# EAGLE schematic MCDU (EAGLE 7.5.0)
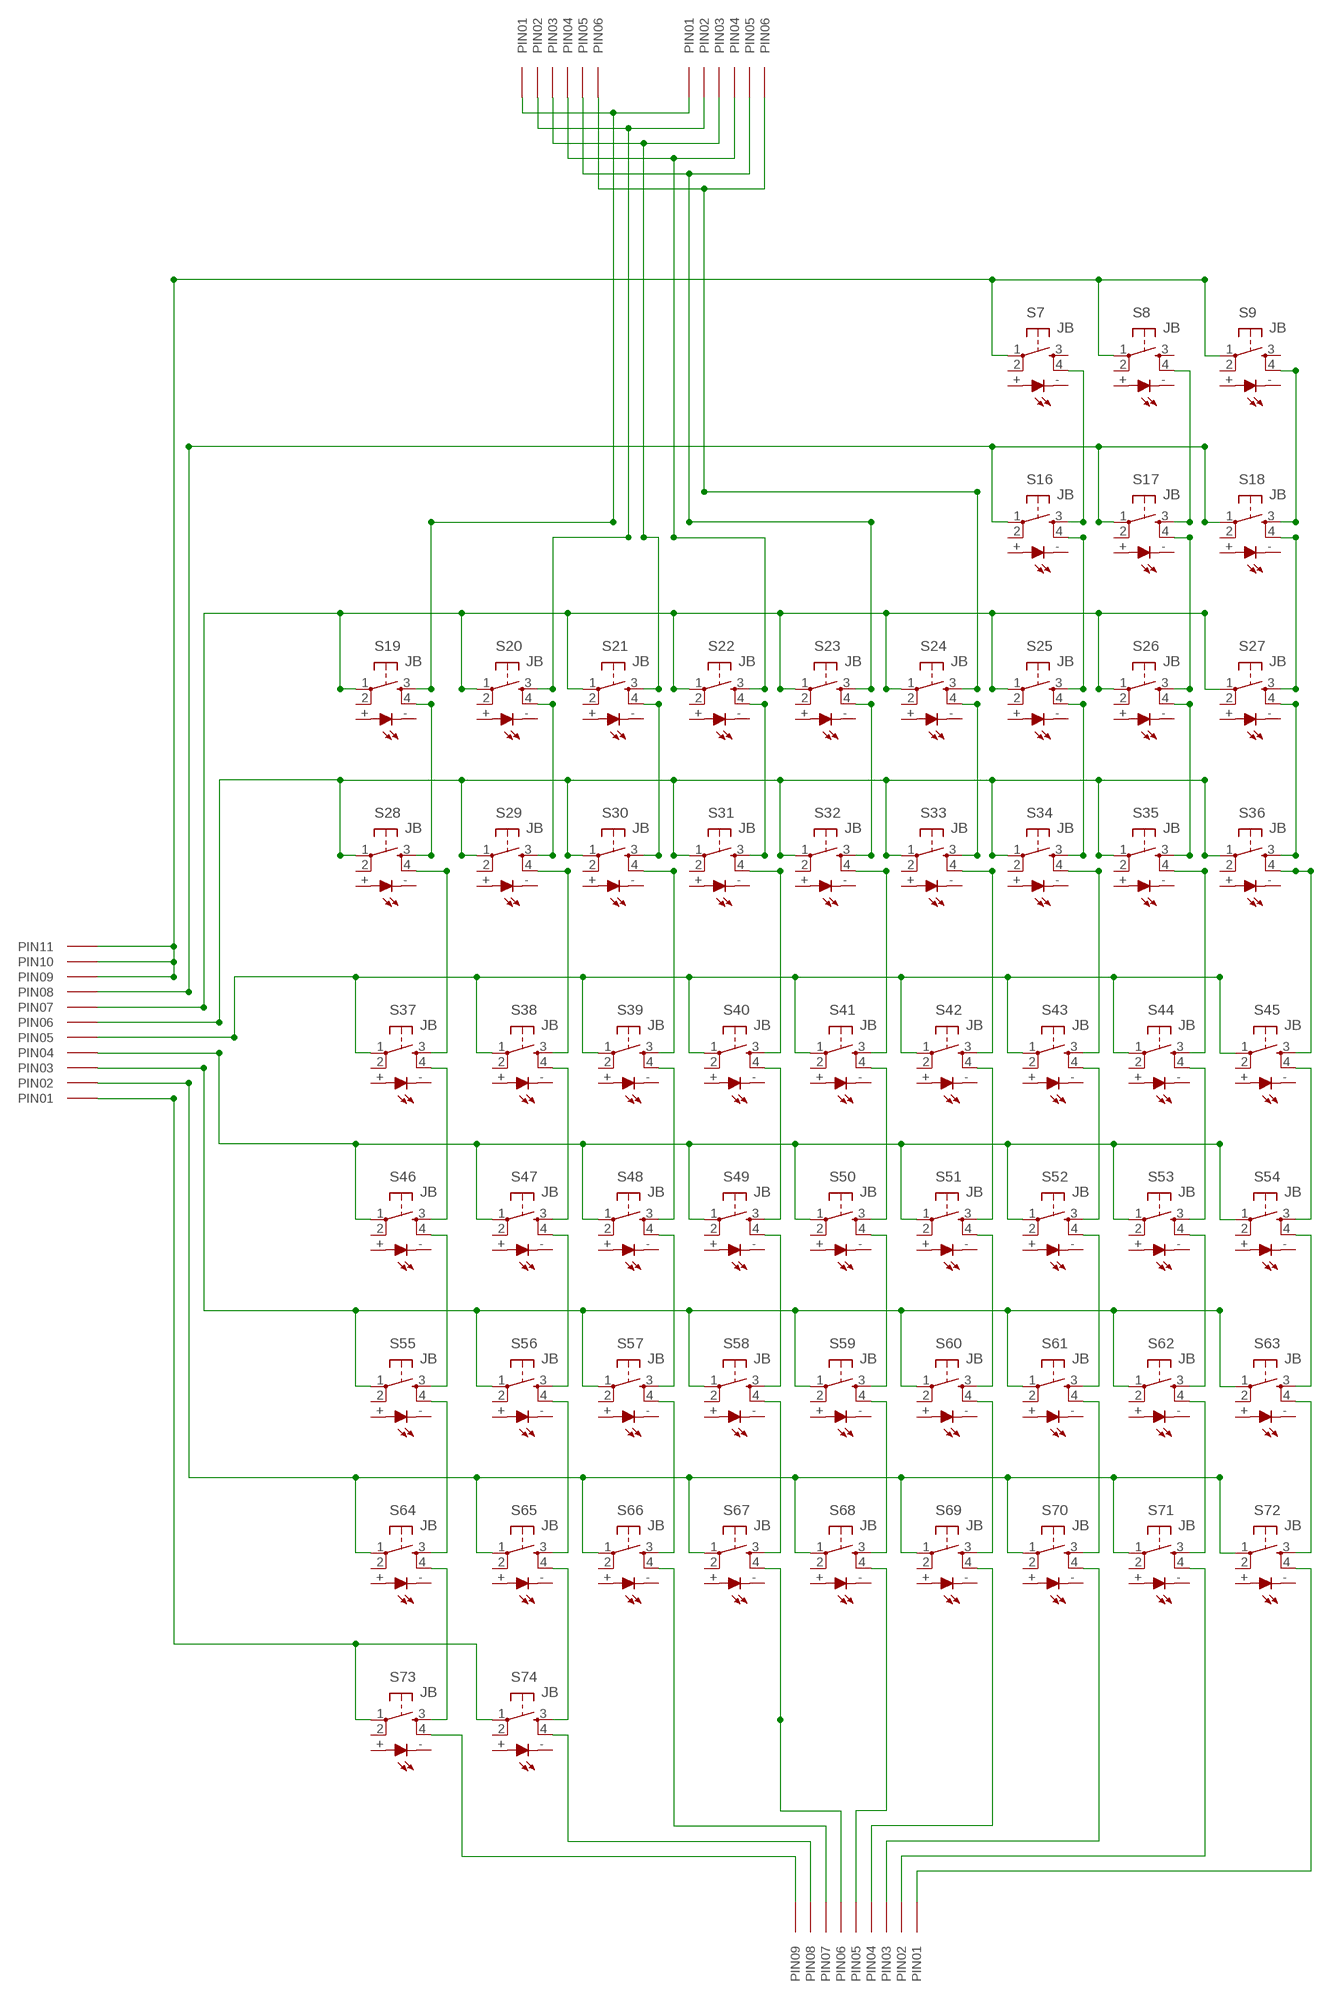
[diagram p0: schematic, sheet 1]

## Parts
S7  JB  [JB]
S8  JB  [JB]
S9  JB  [JB]
S16  JB  [JB]
S17  JB  [JB]
S18  JB  [JB]
S19  JB  [JB]
S20  JB  [JB]
S21  JB  [JB]
S22  JB  [JB]
S23  JB  [JB]
S24  JB  [JB]
S25  JB  [JB]
S26  JB  [JB]
S27  JB  [JB]
S28  JB  [JB]
S29  JB  [JB]
S30  JB  [JB]
S31  JB  [JB]
S32  JB  [JB]
S33  JB  [JB]
S34  JB  [JB]
S35  JB  [JB]
S36  JB  [JB]
S37  JB  [JB]
S38  JB  [JB]
S39  JB  [JB]
S40  JB  [JB]
S41  JB  [JB]
S42  JB  [JB]
S43  JB  [JB]
S44  JB  [JB]
S45  JB  [JB]
S46  JB  [JB]
S47  JB  [JB]
S48  JB  [JB]
S49  JB  [JB]
S50  JB  [JB]
S51  JB  [JB]
S52  JB  [JB]
S53  JB  [JB]
S54  JB  [JB]
S55  JB  [JB]
S56  JB  [JB]
S57  JB  [JB]
S58  JB  [JB]
S59  JB  [JB]
S60  JB  [JB]
S61  JB  [JB]
S62  JB  [JB]
S63  JB  [JB]
S64  JB  [JB]
S65  JB  [JB]
S66  JB  [JB]
S67  JB  [JB]
S68  JB  [JB]
S69  JB  [JB]
S70  JB  [JB]
S71  JB  [JB]
S72  JB  [JB]
S73  JB  [JB]
S74  JB  [JB]
U$2  11PINOS  [11PINOS]
U$3  09PINOS  [09PINOS]
U$5  06PINOS  [06PINOS]
U$6  06PINOS  [06PINOS]

## Nets
N$1: S7.1(P) S8.1(P) S9.1(P) U$2.PIN09 U$2.PIN10 U$2.PIN11
N$2: S16.1(P) S17.1(P) S18.1(P) U$2.PIN08
N$9: S7.4(S1) S16.3(S)
N$10: S8.4(S1) S17.3(S)
N$11: S9.4(S1) S18.3(S)
N$12: S19.1(P) S20.1(P) S21.1(P) S22.1(P) S23.1(P) S24.1(P) S25.1(P) S26.1(P) S27.1(P) U$2.PIN07
N$13: S28.1(P) S29.1(P) S30.1(P) S31.1(P) S32.1(P) S33.1(P) S34.1(P) S35.1(P) S36.1(P) U$2.PIN06
N$14: S20.4(S1) S29.3(S)
N$15: S21.4(S1) S30.3(S)
N$16: S22.4(S1) S31.3(S)
N$17: S19.4(S1) S28.3(S)
N$18: S23.4(S1) S32.3(S)
N$19: S24.4(S1) S33.3(S)
N$20: S25.4(S1) S34.3(S)
N$21: S26.4(S1) S35.3(S)
N$22: S27.4(S1) S36.3(S)
N$23: S19.3(S) U$5.PIN01 U$6.PIN01
N$24: S20.3(S) U$5.PIN02 U$6.PIN02
N$25: S21.3(S) U$5.PIN03 U$6.PIN03
N$26: S22.3(S) U$5.PIN04 U$6.PIN04
N$27: S23.3(S) U$5.PIN05 U$6.PIN05
N$28: S24.3(S) U$5.PIN06 U$6.PIN06
N$29: S16.4(S1) S25.3(S)
N$30: S17.4(S1) S26.3(S)
N$31: S18.4(S1) S27.3(S)
N$32: S37.1(P) S38.1(P) S39.1(P) S40.1(P) S41.1(P) S42.1(P) S43.1(P) S44.1(P) S45.1(P) U$2.PIN05
N$33: S46.1(P) S47.1(P) S48.1(P) S49.1(P) S50.1(P) S51.1(P) S52.1(P) S53.1(P) S54.1(P) U$2.PIN04
N$34: S38.4(S1) S47.3(S)
N$35: S39.4(S1) S48.3(S)
N$36: S40.4(S1) S49.3(S)
N$37: S37.4(S1) S46.3(S)
N$38: S41.4(S1) S50.3(S)
N$39: S42.4(S1) S51.3(S)
N$40: S43.4(S1) S52.3(S)
N$41: S44.4(S1) S53.3(S)
N$42: S45.4(S1) S54.3(S)
N$43: S55.1(P) S56.1(P) S57.1(P) S58.1(P) S59.1(P) S60.1(P) S61.1(P) S62.1(P) S63.1(P) U$2.PIN03
N$44: S64.1(P) S65.1(P) S66.1(P) S67.1(P) S68.1(P) S69.1(P) S70.1(P) S71.1(P) S72.1(P) U$2.PIN02
N$45: S56.4(S1) S65.3(S)
N$46: S57.4(S1) S66.3(S)
N$47: S58.4(S1) S67.3(S)
N$48: S55.4(S1) S64.3(S)
N$49: S59.4(S1) S68.3(S)
N$50: S60.4(S1) S69.3(S)
N$51: S61.4(S1) S70.3(S)
N$52: S62.4(S1) S71.3(S)
N$53: S63.4(S1) S72.3(S)
N$54: S46.4(S1) S55.3(S)
N$55: S47.4(S1) S56.3(S)
N$56: S48.4(S1) S57.3(S)
N$57: S49.4(S1) S58.3(S)
N$58: S50.4(S1) S59.3(S)
N$59: S51.4(S1) S60.3(S)
N$60: S52.4(S1) S61.3(S)
N$61: S53.4(S1) S62.3(S)
N$62: S54.4(S1) S63.3(S)
N$63: S28.4(S1) S37.3(S)
N$64: S29.4(S1) S38.3(S)
N$65: S30.4(S1) S39.3(S)
N$66: S31.4(S1) S40.3(S)
N$67: S32.4(S1) S41.3(S)
N$68: S33.4(S1) S42.3(S)
N$69: S34.4(S1) S43.3(S)
N$70: S35.4(S1) S44.3(S)
N$71: S36.4(S1) S45.3(S)
N$72: S73.1(P) S74.1(P) U$2.PIN01
N$73: S65.4(S1) S74.3(S)
N$75: S67.4(S1) U$3.PIN06
N$76: S64.4(S1) S73.3(S)
N$81: S72.4(S1) U$3.PIN01
N$82: S73.4(S1) U$3.PIN09
N$83: S74.4(S1) U$3.PIN08
N$84: S66.4(S1) U$3.PIN07
N$86: S68.4(S1) U$3.PIN05
N$87: S69.4(S1) U$3.PIN04
N$88: S70.4(S1) U$3.PIN03
N$89: S71.4(S1) U$3.PIN02
Unconnected: S7.2(P1) S7.3(S) S7.+(A) S7.-(C) S8.2(P1) S8.3(S) S8.+(A) S8.-(C) S9.2(P1) S9.3(S) S9.+(A) S9.-(C) S16.2(P1) S16.+(A) S16.-(C) S17.2(P1) S17.+(A) S17.-(C) S18.2(P1) S18.+(A) S18.-(C) S19.2(P1) S19.+(A) S19.-(C) S20.2(P1) S20.+(A) S20.-(C) S21.2(P1) S21.+(A) S21.-(C) S22.2(P1) S22.+(A) S22.-(C) S23.2(P1) S23.+(A) S23.-(C) S24.2(P1) S24.+(A) S24.-(C) S25.2(P1) S25.+(A) S25.-(C) S26.2(P1) S26.+(A) S26.-(C) S27.2(P1) S27.+(A) S27.-(C) S28.2(P1) S28.+(A) S28.-(C) S29.2(P1) S29.+(A) S29.-(C) S30.2(P1) S30.+(A) S30.-(C) S31.2(P1) S31.+(A) S31.-(C) S32.2(P1) S32.+(A) S32.-(C) S33.2(P1) S33.+(A) S33.-(C) S34.2(P1) S34.+(A) S34.-(C) S35.2(P1) S35.+(A) S35.-(C) S36.2(P1) S36.+(A) S36.-(C) S37.2(P1) S37.+(A) S37.-(C) S38.2(P1) S38.+(A) S38.-(C) S39.2(P1) S39.+(A) S39.-(C) S40.2(P1) S40.+(A) S40.-(C) S41.2(P1) S41.+(A) S41.-(C) S42.2(P1) S42.+(A) S42.-(C) S43.2(P1) S43.+(A) S43.-(C) S44.2(P1) S44.+(A) S44.-(C) S45.2(P1) S45.+(A) S45.-(C) S46.2(P1) S46.+(A) S46.-(C) S47.2(P1) S47.+(A) S47.-(C) S48.2(P1) S48.+(A) S48.-(C) S49.2(P1) S49.+(A) S49.-(C) S50.2(P1) S50.+(A) S50.-(C) S51.2(P1) S51.+(A) S51.-(C) S52.2(P1) S52.+(A) S52.-(C) S53.2(P1) S53.+(A) S53.-(C) S54.2(P1) S54.+(A) S54.-(C) S55.2(P1) S55.+(A) S55.-(C) S56.2(P1) S56.+(A) S56.-(C) S57.2(P1) S57.+(A) S57.-(C) S58.2(P1) S58.+(A) S58.-(C) S59.2(P1) S59.+(A) S59.-(C) S60.2(P1) S60.+(A) S60.-(C) S61.2(P1) S61.+(A) S61.-(C) S62.2(P1) S62.+(A) S62.-(C) S63.2(P1) S63.+(A) S63.-(C) S64.2(P1) S64.+(A) S64.-(C) S65.2(P1) S65.+(A) S65.-(C) S66.2(P1) S66.+(A) S66.-(C) S67.2(P1) S67.+(A) S67.-(C) S68.2(P1) S68.+(A) S68.-(C) S69.2(P1) S69.+(A) S69.-(C) S70.2(P1) S70.+(A) S70.-(C) S71.2(P1) S71.+(A) S71.-(C) S72.2(P1) S72.+(A) S72.-(C) S73.2(P1) S73.+(A) S73.-(C) S74.2(P1) S74.+(A) S74.-(C)

## Library data of the parts
S7-S9 S16-S74 = switch-nkk:JB: JB Series - tact with LED backlight
U$2 = Arduino-clone:11PINOS
U$3 = Arduino-clone:09PINOS
U$5 U$6 = Arduino-clone:06PINOS